# Altium project SensorDisplay.PrjPcb
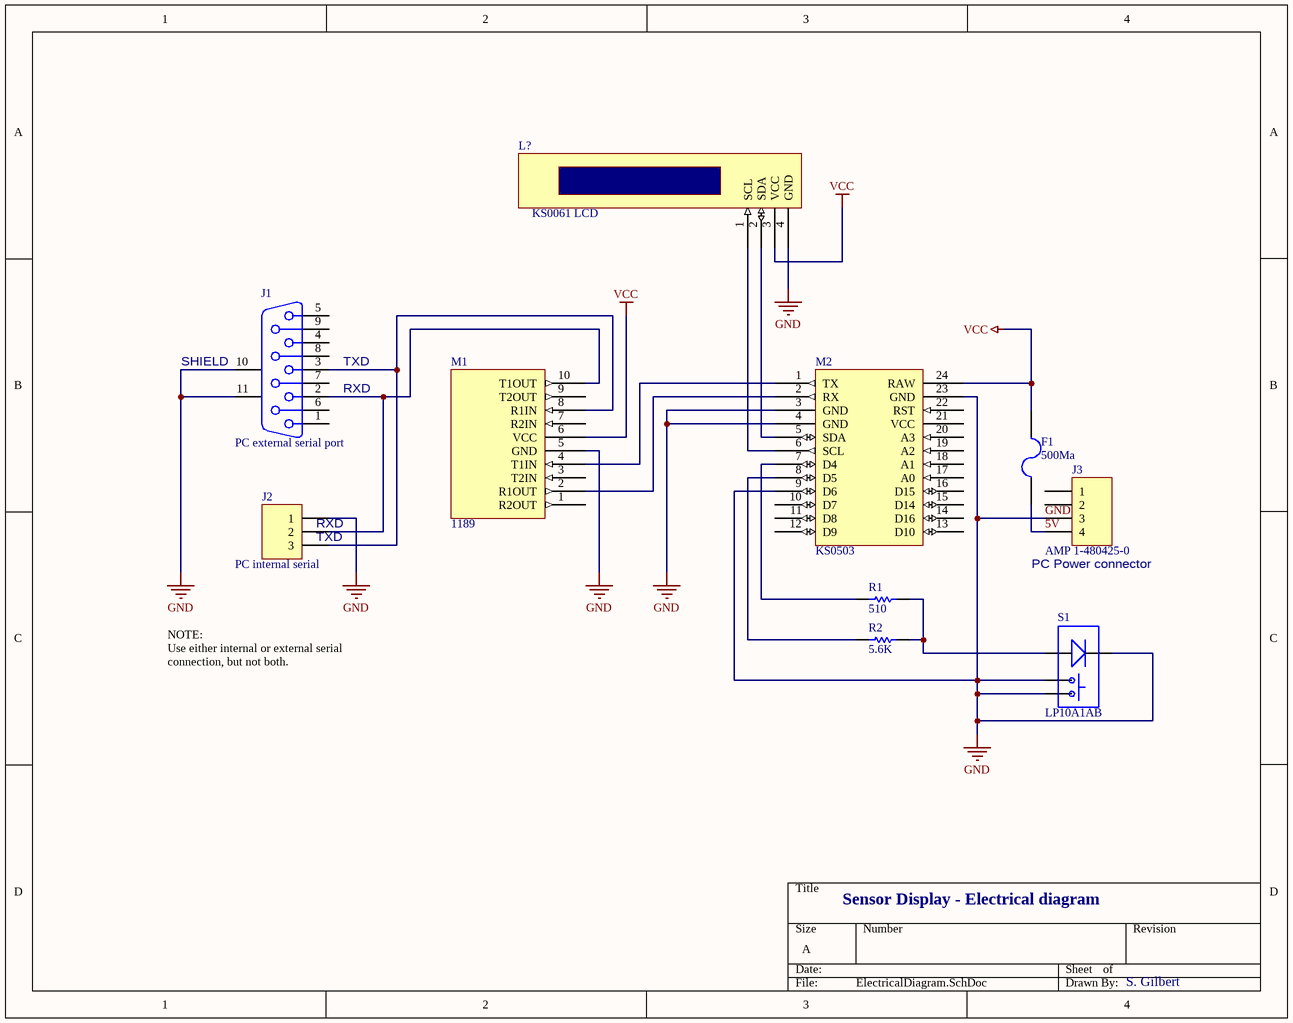
[diagram p0: ElectricalDiagram.SchDoc]
2 sheets, 20 parts. Net scope: global (net labels, ports and power ports of the same name join across sheets).
Sheets:
  ElectricalDiagram.SchDoc
  WiringDiagram.SchDoc

## Sheet ElectricalDiagram.SchDoc
size A

### Parts
(Parts that share a designator on the sheet are numbered #1, #2 ... from top to bottom, then left to right.)
F1#1  500Ma  [PIN-W2/E2.8]
J1  PC external serial port  [DSUB1.385-2H9]
J2  PC internal serial  [HDR1X3]
J3  AMP 1-480425-0  [HDR1X4]
L?  KS0061 LCD
M1  1189
M2  KS0503
R1#1  510  [AXIAL-0.3]
R2#1  5.6K  [AXIAL-0.3]
S1#1  LP10A1AB

### Nets
GND: J1.10(MH1) J1.11(MH2) J2.1 J3.3 L?.4(GND) M1.5(GND) M2.3(GND) M2.4(GND) M2.9(D6) M2.23(GND) S1#1.2(K) S1#1.3 S1#1.4
VCC: F1#1.2 L?.3(VCC) M1.6(VCC) M2.24(RAW)
5V: F1#1.1 J3.4
NetJ1_2: J1.2 J2.2 M1.10(T1OUT)
NetJ1_3: J1.3 J2.3 M1.8(R1IN)
NetL?_1: L?.1(SCL) M2.6(SCL)
NetL?_2: L?.2(SDA) M2.5(SDA)
NetM1_2: M1.2(R1OUT) M2.2(RX)
NetM1_4: M1.4(T1IN) M2.1(TX)
NetM2_7: M2.7(D4) R1#1.1
NetM2_8: M2.8(D5) R2#1.1
NetR1#1_2: R1#1.2 R2#1.2 S1#1.1(A)

Not connected (* = marked no-connect by the designer): J1 1 4 5 6 7 8 9; J3 1 2; M1 1(R2OUT) 3(T2IN) 7(R2IN) 9(T2OUT); M2 10(D7) 11(D8) 12(D9) 13(D10) 14(D16) 15(D14) 16(D15) 17(A0) 18(A1) 19(A2) 20(A3) 21(VCC) 22(RST)

### Notes on the sheet
- (near J1) SHIELD
- (near J1) TXD
- (near J1) RXD
- (near J2) RXD
- (near J2) TXD
- (near J3) PC Power connector
- NOTE:
  Use either internal or external serial connection, but not both.
- Sensor Display - Electrical diagram
- S. Gilbert

### Library data of the parts
F1#1 = Fuse 2: Fuse; Published: 8-Jun-2000; LatestRevisionDate: 17-Jul-2002; LatestRevisionNote: Re-released for DXP Platform.; PackageReference: PIN-W2/E2.8; Publisher: Altium Limited; PackageDescription: Thru-Hole; 2 Leads
J1 = D Connector 9: Receptacle Assembly, 9 Position, Right Angle; PackageDocument: O; Positions: 9; Published: 15-Jun-2001; LatestRevisionDate: 17-Jul-2002; LatestRevisionNote: Re-released for DXP Platform.; DatasheetDocument: 1-Sep-1999; PackageReference: 788750; Publisher: Altium Limited; Orientation: Right Angle; Gender: Receptacle
J2 = Header 3: Header, 3-Pin; LatestRevisionDate: 17-Jul-2002; LatestRevisionNote: Re-released for DXP Platform.; Publisher: Altium Limited
J3 = Header 4: Header, 4-Pin; LatestRevisionDate: 17-Jul-2002; LatestRevisionNote: Re-released for DXP Platform.; Publisher: Altium Limited
L? = KS0061
M1 = 11189: MAX3232 Tranceiver
R1#1 = Res1: Resistor; Published: 8-Jun-2000; LatestRevisionDate: 17-Jul-2002; LatestRevisionNote: Re-released for DXP Platform.; PackageReference: AXIAL-0.3; Publisher: Altium Limited; PackageDescription: Axial Device, Thru-Hole; 2 Leads; 0.3 in Pin Spacing; Value: 510
R2#1 = Res1: Resistor; Value: 1K; Published: 8-Jun-2000; LatestRevisionDate: 17-Jul-2002; LatestRevisionNote: Re-released for DXP Platform.; PackageReference: AXIAL-0.3; Publisher: Altium Limited; PackageDescription: Axial Device, Thru-Hole; 2 Leads; 0.3 in Pin Spacing
S1#1 = Push_Button_led

## Sheet WiringDiagram.SchDoc
size A
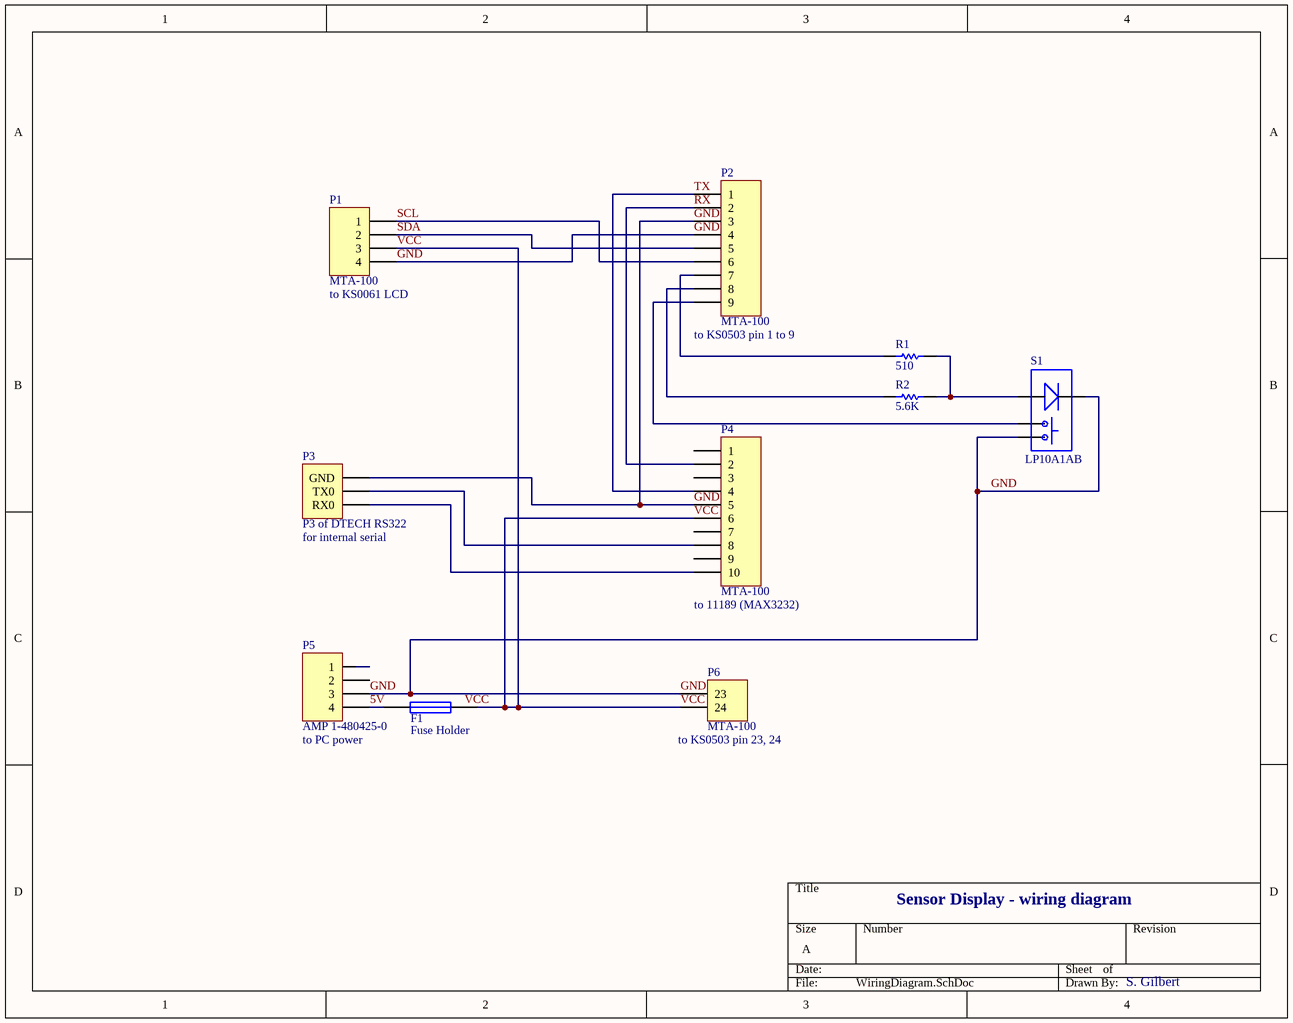
[diagram p1: WiringDiagram.SchDoc]

### Parts
(Parts that share a designator on the sheet are numbered #1, #2 ... from top to bottom, then left to right.)
F1#2  Fuse Holder  [PIN-W2/E2.8]
P1  MTA-100  Desc: to KS0061 LCD  [HDR1X4]
P2  MTA-100  Desc: to KS0503 pin 1 to 9  [HDR1X9]
P3  P3 of DTECH RS322  desc: for internal serial  [HDR1X3]
P4  MTA-100  Desc: to 11189 (MAX3232)  [HDR1X10]
P5  AMP 1-480425-0  Desc: to PC power  [HDR1X4]
P6  MTA-100  Desk: to KS0503 pin 23, 24  [HDR1X2]
R1#2  510  [AXIAL-0.3]
R2#2  5.6K  [AXIAL-0.3]
S1#2  LP10A1AB

### Nets
GND: P1.4 P2.3 P2.4 P3.GND P4.5 P5.3 P6.23 S1#2.2(K) S1#2.4
VCC: F1#2.2 P1.3 P4.6 P6.24
5V: F1#2.1 P5.4
RX: P2.2 P4.2
SCL: P1.1 P2.6
SDA: P1.2 P2.5
TX: P2.1 P4.4
NetP2_7: P2.7 R1#2.1
NetP2_8: P2.8 R2#2.1
NetP2_9: P2.9 S1#2.3
NetP3_RX0: P3.RX0 P4.10
NetP3_TX0: P3.TX0 P4.8
NetR1#2_2: R1#2.2 R2#2.2 S1#2.1(A)

Not connected (* = marked no-connect by the designer): P4 1 3 7 9; P5 1 2

### Notes on the sheet
- Sensor Display - wiring diagram
- S. Gilbert
- Labels drawn without touching a wire or pin: VCC

### Library data of the parts
F1#2 = Fuse 1: Fuse; Published: 8-Jun-2000; LatestRevisionDate: 17-Jul-2002; LatestRevisionNote: Re-released for DXP Platform.; PackageReference: PIN-W2/E2.8; Publisher: Altium Limited; PackageDescription: Thru-Hole; 2 Leads
P1 P5 = Header 4: Header, 4-Pin; LatestRevisionDate: 17-Jul-2002; LatestRevisionNote: Re-released for DXP Platform.; Publisher: Altium Limited
P2 = Header 9: Header, 9-Pin; LatestRevisionDate: 17-Jul-2002; LatestRevisionNote: Re-released for DXP Platform.; Publisher: Altium Limited
P3 = Header 3: Header, 3-Pin; LatestRevisionDate: 17-Jul-2002; LatestRevisionNote: Re-released for DXP Platform.; Publisher: Altium Limited
P4 = Header 10: Header, 10-Pin; LatestRevisionDate: 17-Jul-2002; LatestRevisionNote: Re-released for DXP Platform.; Publisher: Altium Limited
P6 = Header 2: Header, 2-Pin; LatestRevisionDate: 17-Jul-2002; LatestRevisionNote: Re-released for DXP Platform.; Publisher: Altium Limited
R1#2 = Res1: Resistor; Published: 8-Jun-2000; LatestRevisionDate: 17-Jul-2002; LatestRevisionNote: Re-released for DXP Platform.; PackageReference: AXIAL-0.3; Publisher: Altium Limited; PackageDescription: Axial Device, Thru-Hole; 2 Leads; 0.3 in Pin Spacing; Value: 510
R2#2 = Res1: Resistor; Value: 1K; Published: 8-Jun-2000; LatestRevisionDate: 17-Jul-2002; LatestRevisionNote: Re-released for DXP Platform.; PackageReference: AXIAL-0.3; Publisher: Altium Limited; PackageDescription: Axial Device, Thru-Hole; 2 Leads; 0.3 in Pin Spacing
S1#2 = Push_Button_led

## Nets that join several sheets
GND: ElectricalDiagram (13 pins), WiringDiagram (9 pins)
VCC: ElectricalDiagram (F1#1.2 L?.3 M1.6 M2.24), WiringDiagram (F1#2.2 P1.3 P4.6 P6.24)
5V: ElectricalDiagram (F1#1.1 J3.4), WiringDiagram (F1#2.1 P5.4)